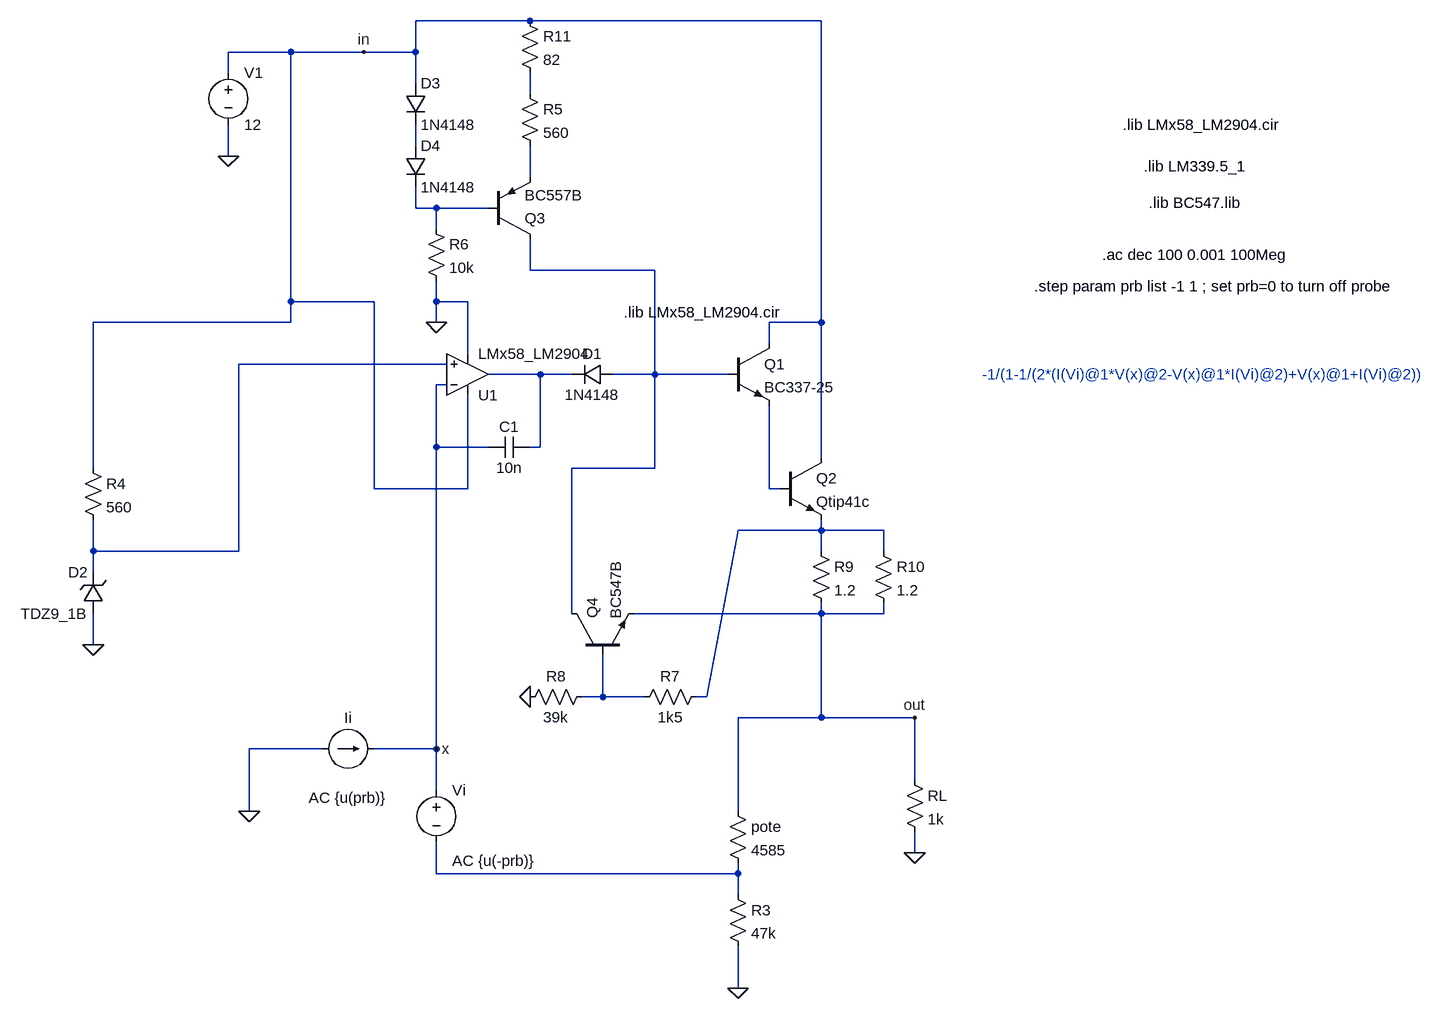
[diagram p0: schematic e2_tp1(Con_Protec) simlazo.asc]
e2_tp1(Con_Protec) simlazo.asc, the LTspice schematic file:
Version 4
SHEET 1 1356 1060
WIRE -144 -448 -320 -448
WIRE 304 -448 -144 -448
WIRE -512 -400 -608 -400
WIRE -400 -400 -512 -400
WIRE -320 -400 -320 -448
WIRE -320 -400 -400 -400
WIRE -608 -368 -608 -400
WIRE -320 -352 -320 -400
WIRE -144 -336 -144 -368
WIRE -320 -256 -320 -288
WIRE -608 -240 -608 -288
WIRE -144 -208 -144 -256
WIRE -320 -160 -320 -192
WIRE -288 -160 -320 -160
WIRE -208 -160 -288 -160
WIRE -288 -128 -288 -160
WIRE -144 -64 -144 -112
WIRE 48 -64 -144 -64
WIRE -512 -16 -512 -400
WIRE -384 -16 -512 -16
WIRE -288 -16 -288 -48
WIRE -240 -16 -288 -16
WIRE -512 16 -512 -16
WIRE -512 16 -816 16
WIRE -288 16 -288 -16
WIRE 304 16 304 -448
WIRE 304 16 224 16
WIRE 224 48 224 16
WIRE -240 64 -240 -16
WIRE -272 80 -592 80
WIRE -128 96 -208 96
WIRE -80 96 -128 96
WIRE 48 96 48 -64
WIRE 48 96 -16 96
WIRE 160 96 48 96
WIRE -272 112 -288 112
WIRE -288 208 -288 112
WIRE -208 208 -288 208
WIRE -128 208 -128 96
WIRE -128 208 -144 208
WIRE 304 224 304 16
WIRE -816 240 -816 16
WIRE 48 240 48 96
WIRE 48 240 -80 240
WIRE -384 272 -384 -16
WIRE -240 272 -240 128
WIRE -240 272 -384 272
WIRE 224 272 224 144
WIRE 240 272 224 272
WIRE 304 336 304 320
WIRE 304 336 176 336
WIRE 400 336 304 336
WIRE -816 368 -816 320
WIRE -592 368 -592 80
WIRE -592 368 -816 368
WIRE 304 368 304 336
WIRE 400 368 400 336
WIRE -816 400 -816 368
WIRE -80 464 -80 240
WIRE 304 464 304 448
WIRE 304 464 16 464
WIRE 400 464 400 448
WIRE 400 464 304 464
WIRE -816 512 -816 464
WIRE -32 592 -32 528
WIRE -32 592 -64 592
WIRE 32 592 -32 592
WIRE 128 592 176 336
WIRE 128 592 112 592
WIRE 304 624 304 464
WIRE 304 624 176 624
WIRE 448 624 304 624
WIRE -464 672 -576 672
WIRE -288 672 -288 208
WIRE -288 672 -384 672
WIRE 448 720 448 624
WIRE -288 736 -288 672
WIRE -576 768 -576 672
WIRE 176 768 176 624
WIRE 448 832 448 800
WIRE -288 864 -288 816
WIRE 176 864 176 848
WIRE 176 864 -288 864
WIRE 176 896 176 864
WIRE 176 1040 176 976
FLAG 448 832 0
FLAG 176 1040 0
FLAG -816 512 0
FLAG -400 -400 in
FLAG -608 -240 0
FLAG 448 624 out
FLAG -288 16 0
FLAG -144 592 0
FLAG -576 768 0
FLAG -288 672 x
SYMBOL npn 160 48 R0
SYMATTR InstName Q1
SYMATTR Value BC337-25
SYMBOL npn 240 224 R0
SYMATTR InstName Q2
SYMATTR Value Qtip41c
SYMBOL res 432 704 R0
SYMATTR InstName RL
SYMATTR Value 1k
SYMBOL res 160 752 R0
SYMATTR InstName pote
SYMATTR Value 4585
SYMBOL res 160 880 R0
SYMATTR InstName R3
SYMATTR Value 47k
SYMBOL diode -16 80 R90
WINDOW 0 0 32 VBottom 2
WINDOW 3 32 32 VTop 2
SYMATTR InstName D1
SYMATTR Value 1N4148
SYMBOL zener -800 464 R180
WINDOW 0 24 64 Left 2
WINDOW 3 24 0 Left 2
SYMATTR InstName D2
SYMATTR Value TDZ9_1B
SYMBOL res -832 224 R0
SYMATTR InstName R4
SYMATTR Value 560
SYMBOL diode -336 -352 R0
SYMATTR InstName D3
SYMATTR Value 1N4148
SYMBOL diode -336 -256 R0
SYMATTR InstName D4
SYMATTR Value 1N4148
SYMBOL res -160 -352 R0
SYMATTR InstName R5
SYMATTR Value 560
SYMBOL voltage -608 -384 R0
WINDOW 123 0 0 Left 2
WINDOW 39 0 0 Left 2
SYMATTR InstName V1
SYMATTR Value 12
SYMBOL res -304 -144 R0
SYMATTR InstName R6
SYMATTR Value 10k
SYMBOL pnp -208 -112 M180
SYMATTR InstName Q3
SYMATTR Value BC557B
SYMBOL Opamps\\opamp2 -240 160 M180
SYMATTR InstName U1
SYMATTR Value LMx58_LM2904
SYMBOL npn -80 528 R270
SYMATTR InstName Q4
SYMATTR Value BC547B
SYMBOL res 128 576 R90
WINDOW 0 0 56 VBottom 2
WINDOW 3 32 56 VTop 2
SYMATTR InstName R7
SYMATTR Value 1k5
SYMBOL res -48 576 R90
WINDOW 0 0 56 VBottom 2
WINDOW 3 32 56 VTop 2
SYMATTR InstName R8
SYMATTR Value 39k
SYMBOL res 288 352 R0
SYMATTR InstName R9
SYMATTR Value 1.2
SYMBOL voltage -288 720 R0
WINDOW 123 24 124 Left 2
WINDOW 39 0 0 Left 0
SYMATTR Value2 AC {u(-prb)}
SYMATTR InstName Vi
SYMATTR Value ""
SYMBOL current -464 672 R270
WINDOW 0 32 40 VTop 2
WINDOW 3 -32 40 VBottom 2
WINDOW 123 -60 40 VBottom 2
WINDOW 39 0 0 Left 0
SYMATTR InstName Ii
SYMATTR Value ""
SYMATTR Value2 AC {u(prb)}
SYMBOL res 384 352 R0
SYMATTR InstName R10
SYMATTR Value 1.2
SYMBOL res -160 -464 R0
SYMATTR InstName R11
SYMATTR Value 82
SYMBOL cap -144 192 R90
WINDOW 0 0 32 VBottom 2
WINDOW 3 32 32 VTop 2
SYMATTR InstName C1
SYMATTR Value 10n
TEXT 800 -224 Left 2 !.lib LM339.5_1
TEXT 808 -168 Left 2 !.lib BC547.lib
TEXT 736 -88 Left 2 !.ac dec 100 0.001 100Meg
TEXT 632 -40 Left 2 !.step param prb list -1 1 ; set prb=0 to turn off probe
TEXT 552 96 Left 2 ;-1/(1-1/(2*(I(Vi)@1*V(x)@2-V(x)@1*I(Vi)@2)+V(x)@1+I(Vi)@2))
TEXT 768 -288 Left 2 !.lib LMx58_LM2904.cir
TEXT 0 0 Left 2 !.lib LMx58_LM2904.cir

The netlist it stands for:
* e2_tp1(Con_Protec) simlazo.asc
Q1 in N005 N008 0 BC337-25
Q2 in N008 N009 0 Qtip41c
RL out 0 1k
R§pote out N011 4585
R3 N011 0 47k
D1 N005 N007 1N4148
D2 0 N006 TDZ9_1B
R4 in N006 560
D3 in N002 1N4148
D4 N002 N004 1N4148
R5 N001 N003 560
V1 in 0 12
R6 N004 0 10k
Q3 N005 N004 N003 0 BC557B
XU1 N006 x in 0 N007 LMx58_LM2904  ; pins In+ In- V+ V- OUT
Q4 N005 N010 out 0 BC547B
R7 N009 N010 1k5
R8 N010 0 39k
R9 N009 out 1.2
Vi x N011 AC {u(-prb)}
Ii 0 x AC {u(prb)}
R10 N009 out 1.2
R11 in N001 82
C1 N007 x 10n
.model D D
.lib standard.dio
.model NPN NPN
.model PNP PNP
.lib standard.bjt
.lib LM339.5_1
.lib BC547.lib
.ac dec 100 0.001 100Meg
.step param prb list -1 1 ; set prb=0 to turn off probe
* -1/(1-1/(2*(I(Vi)@1*V(x)@2-V(x)@1*I(Vi)@2)+V(x)@1+I(Vi)@2))
.lib LMx58_LM2904.cir
.lib LMx58_LM2904.cir
.backanno
.end